# EAGLE design untitled (EAGLE 7.3.2)
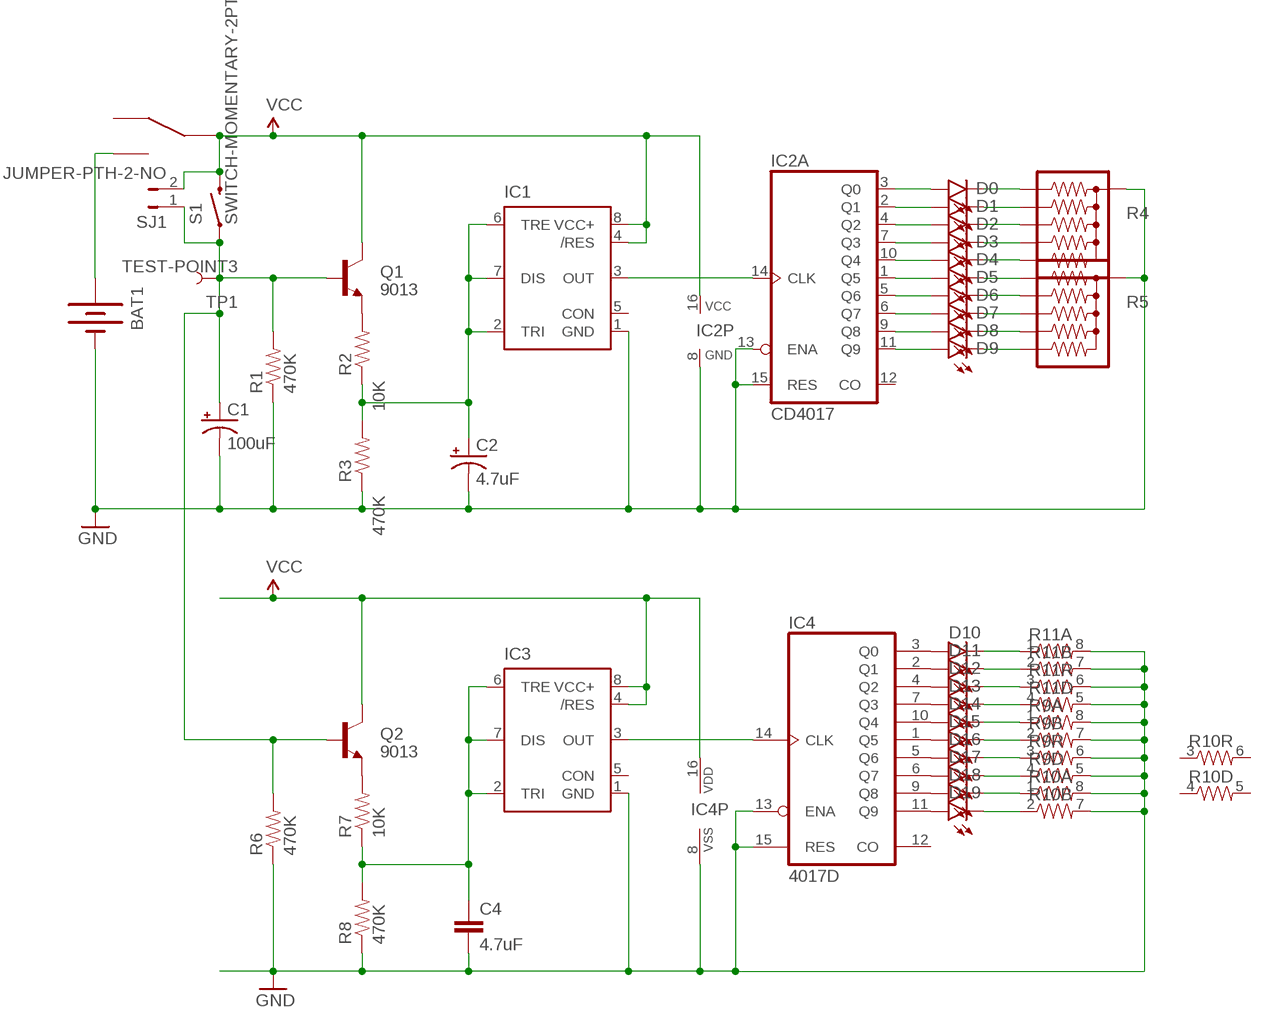
[diagram p0: schematic, sheet 1]

## Parts
BAT1  BATTERY20PTH  [BATTCOM_20MM_PTH]
C1  100uF  CAP_POLPTH1  [CPOL-RADIAL-100UF-25V]
C2  4.7uF  CAP_POLPTH1  [CPOL-RADIAL-100UF-25V]
C4  4.7uF  4.7UF-6.3V-10%(0603)0603  [0603-CAP]
D0  LED3MM  [LED3MM]
D1  LED3MM  [LED3MM]
D2  LED3MM  [LED3MM]
D3  LED3MM  [LED3MM]
D4  LED3MM  [LED3MM]
D5  LED3MM  [LED3MM]
D6  LED3MM  [LED3MM]
D7  LED3MM  [LED3MM]
D8  LED3MM  [LED3MM]
D9  LED3MM  [LED3MM]
D10  LED1206  [LED-1206]
D11  LED1206  [LED-1206]
D12  LED1206  [LED-1206]
D13  LED1206  [LED-1206]
D14  LED1206  [LED-1206]
D15  LED1206  [LED-1206]
D16  LED1206  [LED-1206]
D17  LED1206  [LED-1206]
D18  LED1206  [LED-1206]
D19  LED1206  [LED-1206]
IC1  NE555KIT  [DIP08-KIT]
IC2  CD4017  CD4017KIT  [DIL16-KIT]
IC3  NE555D  [SO08]
IC4  4017D  [SO16]
Q1  9013  TRANSISTOR_NPNTO-92-AMMO  [TO-92-AMMO]
Q2  9013  TRANSISTOR_NPNMMBT2222A  [SOT23-3]
R1  470K  RESISTORPTH-1/4W-VERT  [AXIAL-0.1]
R2  10K  RESISTORPTH-1/4W-VERT  [AXIAL-0.1]
R3  470K  RESISTORPTH-1/4W-VERT  [AXIAL-0.1]
R4  RPACK-BUSSED-5-SIP-PTH-5  [RPACK-SIP-PTH-5]
R5  RPACK-BUSSED-5-SIP-PTH-5  [RPACK-SIP-PTH-5]
R6  470K  470OHM1/10W1%(0603)  [0603-RES]
R7  10K  470OHM1/10W1%(0603)  [0603-RES]
R8  470K  470OHM1/10W1%(0603)  [0603-RES]
R9  RESISTOR-ARRAY0603-ARV  [0603-ARV]
R10  RESISTOR-ARRAY0603-ARV  [0603-ARV]
R11  RESISTOR-ARRAY0603-ARV  [0603-ARV]
S1  SWITCH-MOMENTARY-2PTH  [TACTILE-PTH]
SJ1  JUMPER-PTH-2-NO  [PTH-JUMPER-2-NO_NO_SILK]
TP1  TEST-POINT3  [PAD.03X.03]
U$1  KFT  [SWITCH_LOCK]

## Nets
GND: BAT1.2(-) C1.2(-) C2.2(-) C4.2 IC1.1(GND) IC2.8(P:GND) IC2.13(A:ENA) IC2.15(A:RES) IC3.1(GND) IC4.8(VSS) IC4.13(ENA) IC4.15(RES) R1.P$1 R3.P$1 R4.P$1 R5.P$1 R6.1 R8.1 R9.5 R9.6 R9.7 R9.8 R10.7 R10.8 R11.5 R11.6 R11.7 R11.8
N$1: D10.A IC4.3(Q0)
N$2: C1.1(+) Q1.2(B) Q2.1(B) R1.P$2 R6.2 S1.1 SJ1.1 TP1.P$1
N$3: Q2.2(E) R7.2
N$4: Q1.1(E) R2.P$2
N$5: C2.1(+) IC1.2(TRI) IC1.6(TRE) IC1.7(DIS) R2.P$1 R3.P$2
N$6: C4.1 IC3.2(TRI) IC3.6(TRE) IC3.7(DIS) R7.1 R8.2
N$7: IC3.3(OUT) IC4.14(CLK)
N$8: D11.A IC4.2(Q1)
N$9: D0.A IC2.3(A:Q0)
N$10: D1.A IC2.2(A:Q1)
N$11: D12.A IC4.4(Q2)
N$12: D2.A IC2.4(A:Q2)
N$13: IC1.3(OUT) IC2.14(A:CLK)
N$14: D13.A IC4.7(Q3)
N$15: D14.A IC4.10(Q4)
N$16: D15.A IC4.1(Q5)
N$17: D16.A IC4.5(Q6)
N$18: D17.A IC4.6(Q7)
N$19: D18.A IC4.9(Q8)
N$20: D3.A IC2.7(A:Q3)
N$21: D4.A IC2.10(A:Q4)
N$22: D5.A IC2.1(A:Q5)
N$23: D6.A IC2.5(A:Q6)
N$24: D7.A IC2.6(A:Q7)
N$25: D8.A IC2.9(A:Q8)
N$26: D9.A IC2.11(A:Q9)
N$27: D0.K(C) R4.P$2
N$28: D1.K(C) R4.P$3
N$29: D2.K(C) R4.P$4
N$30: D3.K(C) R4.P$5
N$31: D4.K(C) R4.P$6
N$32: D5.K(C) R5.P$2
N$33: D6.K(C) R5.P$3
N$34: D7.K(C) R5.P$4
N$35: D8.K(C) R5.P$5
N$36: D9.K(C) R5.P$6
N$37: D19.A IC4.11(Q9)
N$38: BAT1.1(+) U$1.S$3 U$1.S$4
N$40: D10.C R11.1
N$41: D11.C R11.2
N$42: D12.C R11.3
N$43: D13.C R11.4
N$44: D14.C R9.1
N$45: D15.C R9.2
N$46: D16.C R9.3
N$47: D17.C R9.4
N$48: D18.C R10.1
N$49: D19.C R10.2
VCC: IC1.4(/RES) IC1.8(VCC+) IC2.16(P:VCC) IC3.4(/RES) IC3.8(VCC+) IC4.16(VDD) Q1.3(C) Q2.3(C) S1.3 SJ1.2 U$1.S$2(P$C) U$1.S$5(P$C)
Unconnected: IC1.5(CON) IC2.12(A:CO) IC3.5(CON) IC4.12(CO) R10.3 R10.4 R10.5 R10.6 U$1.S$1 U$1.S$6

## Library data of the parts
BAT1 = SparkFun-Electromechanical:BATTERY: Battery Holders Various common sizes : AA, AAA, 18650 (PRT-12895), 20mm coin cell and 12mm coin cell. 20MM_4LEGS, BATT-10373
C1 C2 = SparkFun-Capacitors:CAP_POL: Capacitor Polarized These are standard SMD and PTH capacitors. Normally 10uF, 47uF, and 100uF in electrolytic and tantalum varieties. Always verify the external diameter of the through hole cap, it varies with capacity, voltage, and manufacturer. The EIA devices should be standard.
C4 = SparkFun-Capacitors:4.7UF-6.3V-10%(0603): CAP-08280; PROD_ID: CAP-08280
D0 D1-D19 = SparkFun-LED:LED: LEDs Standard schematic elements and footprints for 5mm, 3mm, 1206, and 0603 sized LEDs. 5mm - Spark Fun Electronics SKU : COM-00529 (and others)
IC1 = SparkFun-AnalogIC:NE555: General purpose bipolar Timer; PROD_ID: IC-11930
IC2 = SparkFun-DigitalIC:CD4017; PROD_ID: IC-11929
IC3 = SparkFun-AnalogIC:NE555: General purpose bipolar Timer
IC4 = 40xx:4017: COUNTER/DIVIDER
Q1 = SparkFun-DiscreteSemi:TRANSISTOR_NPN: Generic NPN BJT MMBT2222A - TRANS-08049 (SOT-23, 1A 40V) MPSA42 - TRANS-09116 (SOT-23, 500mA 300V) MMBT5088LT1G - TRANS-11160 (SOT-23, 50 mA 30V) BC547 - COM-08928 <http://www.sparkfun.com/products/8928> (TO-92 45V 100mA) (1.Collector 2.Base 3.Emitter) 2N3904 - COM-00521 <http://www.sparkfun.com/products/521> (TO-92 40V 200mA) (1.Emitter 2.Base 3.Collector) P2N2222A - COM-12852 <http://www.sparkfun.com/products/12852> (TO-92 40V 600mA) (1.Collector 2.Base 3.Emitter)
Q2 = SparkFun-DiscreteSemi:TRANSISTOR_NPN: Generic NPN BJT MMBT2222A - TRANS-08049 (SOT-23, 1A 40V) MPSA42 - TRANS-09116 (SOT-23, 500mA 300V) MMBT5088LT1G - TRANS-11160 (SOT-23, 50 mA 30V) BC547 - COM-08928 <http://www.sparkfun.com/products/8928> (TO-92 45V 100mA) (1.Collector 2.Base 3.Emitter) 2N3904 - COM-00521 <http://www.sparkfun.com/products/521> (TO-92 40V 200mA) (1.Emitter 2.Base 3.Collector) P2N2222A - COM-12852 <http://www.sparkfun.com/products/12852> (TO-92 40V 600mA) (1.Collector 2.Base 3.Emitter); PROD_ID: TRANS-08049; VALUE: MMBT2222A
R1-R3 = SparkFun-Resistors:RESISTOR: Resistor Basic schematic elements and footprints for 0603, 1206, and PTH resistors.
R4 R5 = SparkFun-Resistors:RPACK-BUSSED-5: BOURNS 4600X series thick-film SIP resistor packs Five resistors bussed to a single pin (denoted by dot). 0.2W / resistor datasheet <http://dlnmh9ip6v2uc.cloudfront.net/datasheets/Components/General/4600x.pdf> SFE parts COM-10855 (330), COM-10856 (10K)
R6-R8 = SparkFun-Resistors:470OHM1/10W1%(0603): RES-07869; PROD_ID: RES-07869; VALUE: 470
R9-R11 = SparkFun-Resistors:RESISTOR-ARRAY: Array Chip Resistor Source: RS Component / Phycomp
S1 = SparkFun-Electromechanical:SWITCH-MOMENTARY-2: Various NO switches- pushbuttons, reed, etc; PROD_ID: SWCH-08441
SJ1 = SparkFun-Passives:JUMPER-PTH-2-NO
TP1 = SparkFun-Passives:TEST-POINT: Bare copper test points for troubleshooting or ICT
U$1 = r1:KFT

## Board
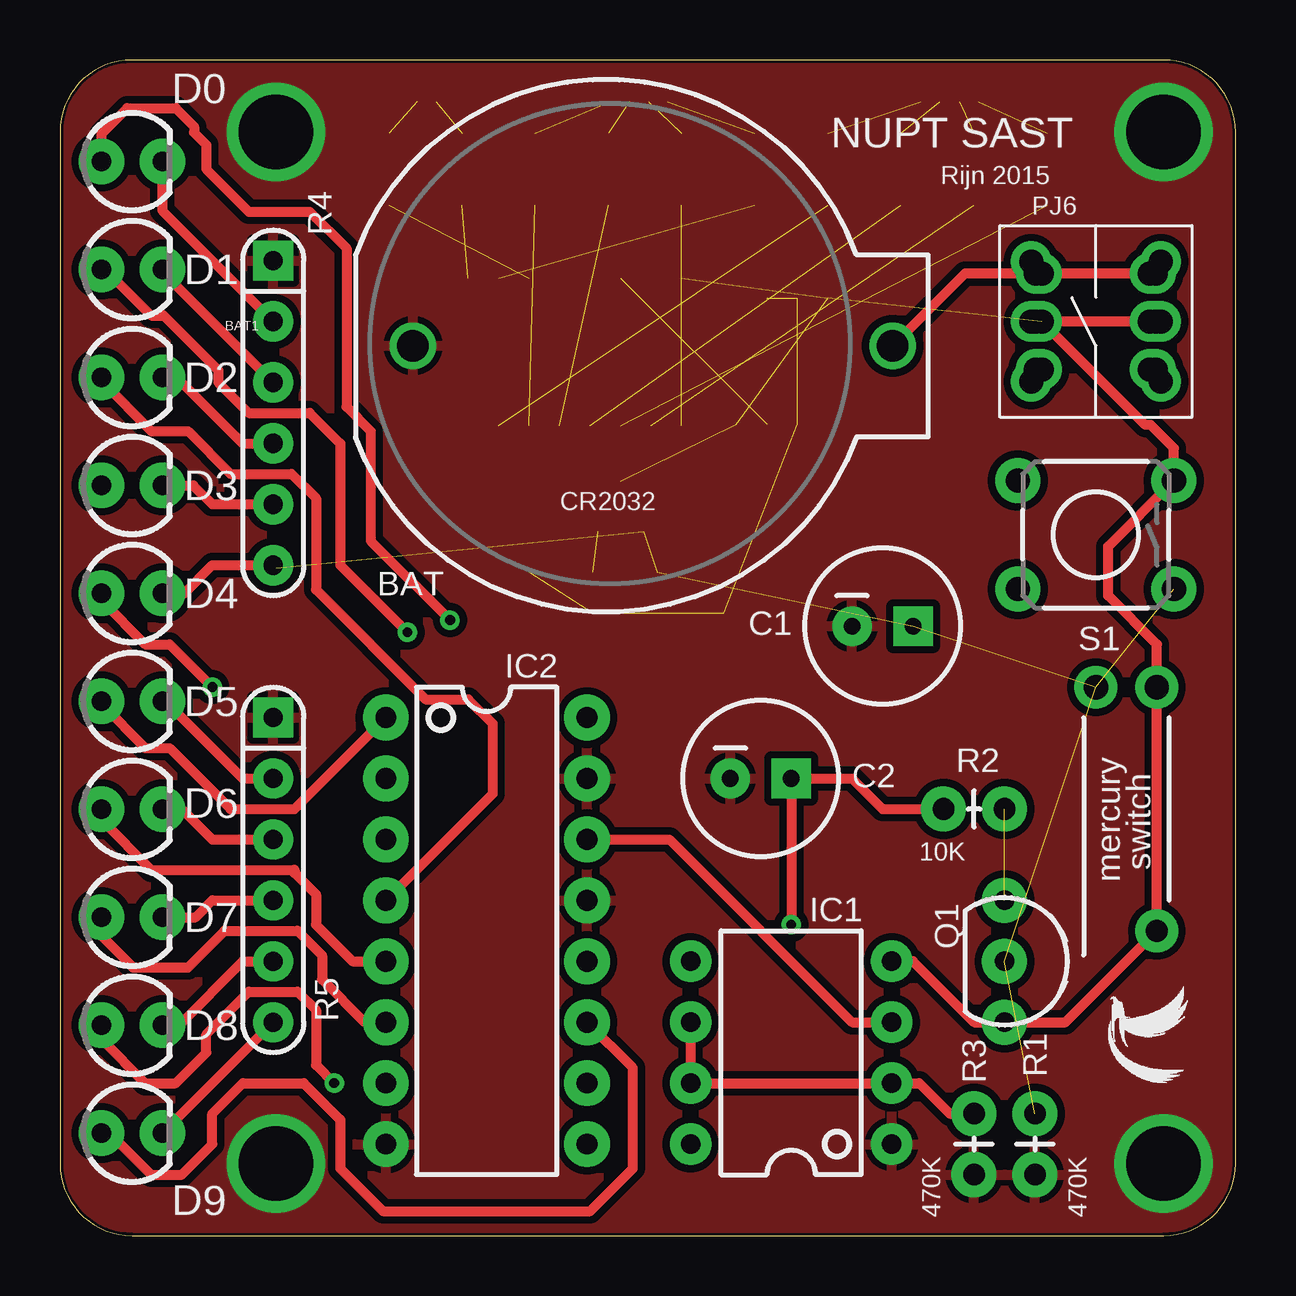
[diagram p1: board, top side]
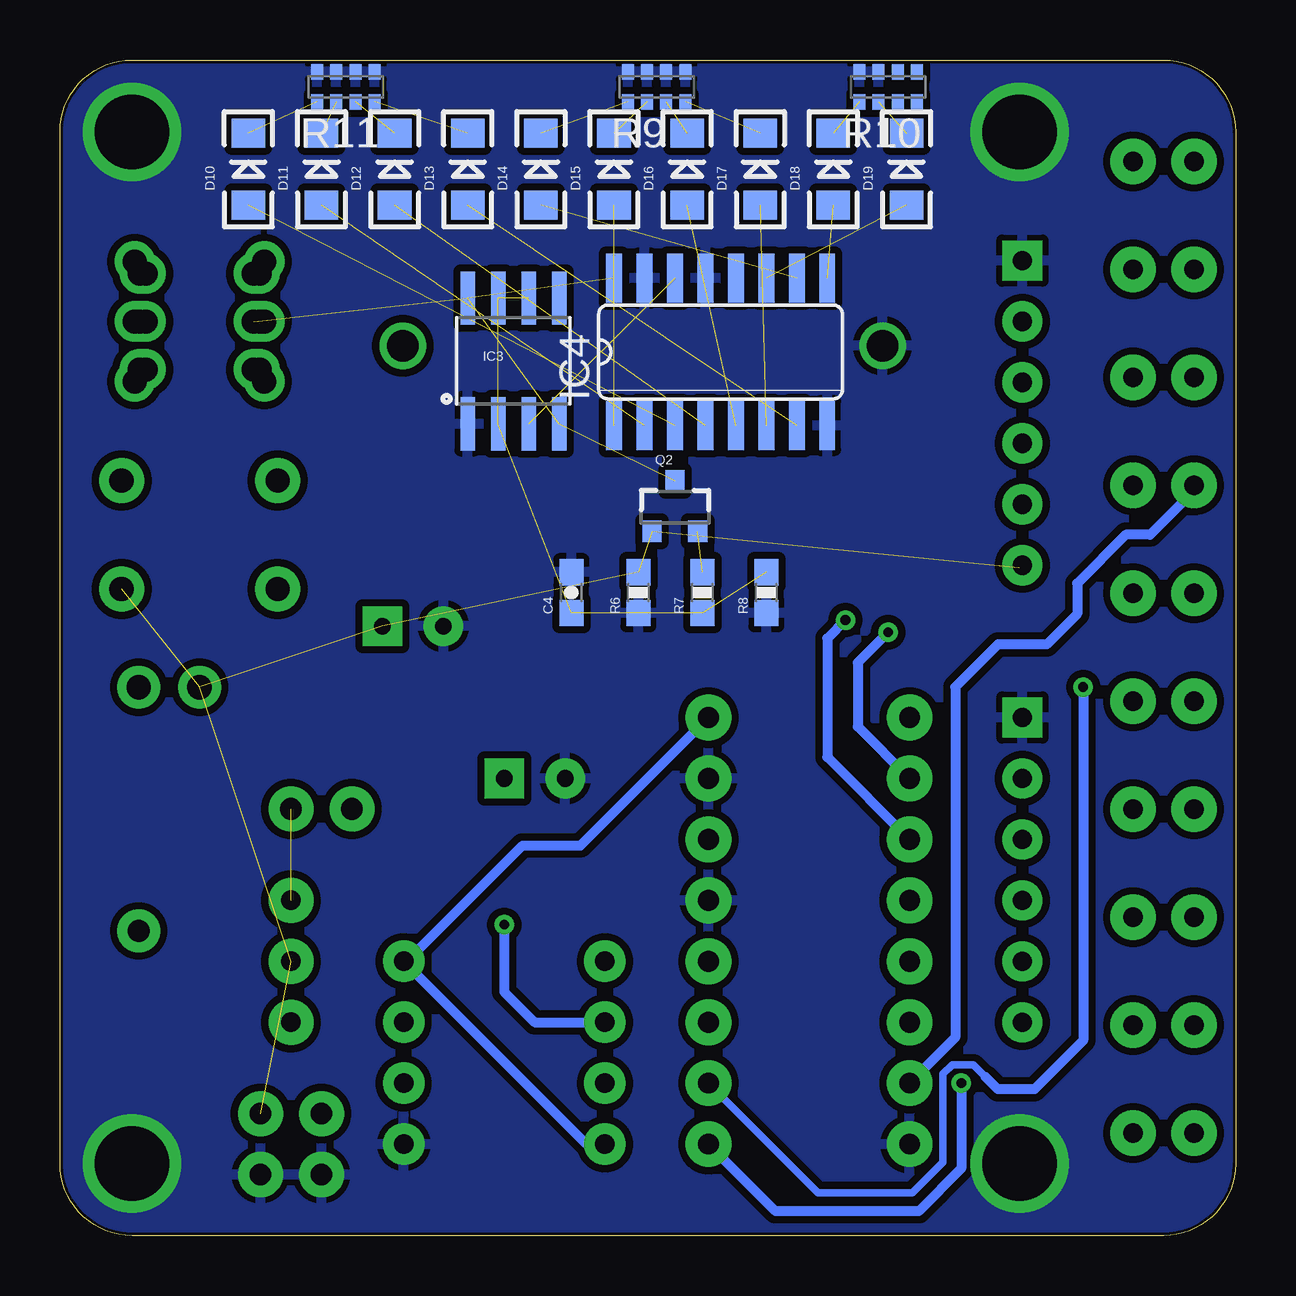
[diagram p2: board, bottom side, seen from below]

Size 49 x 49 mm. Coordinates in mm from the lower left corner, seen from the top.
Outline: 0,46 0,3 arc90 3,0 46,0 arc90 49,3 49,46 arc90 46,49 3,49 arc90 0,46
Copper layers (1*16): Top 0.035mm / dielectric 1.5mm / Bottom 0.035mm
Design rules "default *": minimum track width 6mil, minimum drill 12mil, track to track 12mil, track to pad 6mil, pad to pad 6mil, via to via 6mil, smd to smd 6mil, copper to edge 1mil, drill to drill 6mil, minimum pad ring 10mil, minimum via ring 8mil, stop-mask expansion 4mil, vias tented up to drill 12mil, thermal gap 10mil

### Footprints (pad centres in the part's own frame; a part is rotated, then mirrored left to right if it is on the bottom)
BATTCOM_20MM_PTH = drill 1.3: 1 11.85,0; 2 -8.15,0
CPOL-RADIAL-100UF-25V = drill 0.7 pad 1.651 square: 1 1.27,0 | drill 0.7 pad 1.651: 2 -1.27,0
0603-CAP = smd 1.1 x 1: 1 -0.85,0; 2 0.85,0
LED3MM = drill 0.813 pad 1.88: A -1.27,0; K 1.27,0
LED-1206 = smd 1.2 x 1.4: A -1.5,0; C 1.5,0
DIP08-KIT = drill 0.813 pad 1.727: 1 -3.81,-4.191; 2 -1.27,-4.191; 3 1.27,-4.191; 4 3.81,-4.191; 5 3.81,4.191; 6 1.27,4.191; 7 -1.27,4.191; 8 -3.81,4.191
DIL16-KIT = drill 0.864 pad 1.905: 1 -8.89,-4.191; 2 -6.35,-4.191; 3 -3.81,-4.191; 4 -1.27,-4.191; 5 1.27,-4.191; 6 3.81,-4.191; 7 6.35,-4.191; 8 8.89,-4.191; 9 8.89,4.191; 10 6.35,4.191; 11 3.81,4.191; 12 1.27,4.191; 13 -1.27,4.191; 14 -3.81,4.191; 15 -6.35,4.191; 16 -8.89,4.191
SO08 = smd 0.61 x 2.21: 1 -1.905,-2.616; 2 -0.635,-2.616; 3 0.635,-2.616; 4 1.905,-2.616; 5 1.905,2.616; 6 0.635,2.616; 7 -0.635,2.616; 8 -1.905,2.616
SO16 = smd 0.66 x 2.032: 1 -4.445,-3.073; 2 -3.175,-3.073; 3 -1.905,-3.073; 4 -0.635,-3.073; 5 0.635,-3.073; 6 1.905,-3.073; 7 3.175,-3.073; 8 4.445,-3.073; 9 4.445,3.073; 10 3.175,3.073; 11 1.905,3.073; 12 0.635,3.073; 13 -0.635,3.073; 14 -1.905,3.073; 15 -3.175,3.073; 16 -4.445,3.073
TO-92-AMMO = drill 0.813 pad 1.88: 1 -2.54,0; 2 0,0; 3 2.54,0
SOT23-3 = smd 0.8 x 0.9: 1 -0.95,-1; 2 0.95,-1; 3 0,1.1
AXIAL-0.1 = drill 0.9 pad 1.88: P$1 0,0; P$2 2.54,0
RPACK-SIP-PTH-5 = drill 0.8 pad 1.676 square: P$1 0,0 | drill 0.8 pad 1.676: P$2 0,-2.54; P$3 0,-5.08; P$4 0,-7.62; P$5 0,-10.16; P$6 0,-12.7
0603-RES = smd 1.1 x 1: 1 -0.85,0; 2 0.85,0
0603-ARV = smd 0.5 x 0.65: 1 -1.2,-0.625; 2 -0.4,-0.625; 3 0.4,-0.625; 4 1.2,-0.625; 5 1.2,0.625; 6 0.4,0.625; 7 -0.4,0.625; 8 -1.2,0.625
TACTILE-PTH = drill 1.016 pad 1.88: 1 -3.251,2.261; 2 3.251,2.261; 3 -3.251,-2.261; 4 3.251,-2.261
PTH-JUMPER-2-NO_NO_SILK = drill 1.016 pad 1.778: 1 -1.27,0; 2 1.27,0
PAD.03X.03 = smd 0.762 x 0.762: P$1 0,0
SWITCH_LOCK = drill 1 pad 1.676: P$1 -2.5,2.7; P$2 -2,2.5; P$5 0,2.5; P$6 0,2.7; P$8 2,2.5; P$9 2.5,2.7; P$11 -2,-2.5; P$12 -2.5,-2.7; P$14 0,-2.5; P$15 0,-2.7; P$17 2,-2.5; P$18 2.5,-2.7; S$1 -2,2.25; S$2 0,2.25; S$3 2,2.25; S$4 2,-2.25; S$5 0,-2.25; S$6 -2,-2.25

### Placement (x,y rotation side)
BAT1  22.86,37.08 0 top
C1  34.29,25.4 0 top
C2  29.21,19.05 0 top
C4  27.69,26.8 90 bottom
D0  3,44.77 0 top
D1  3,40.27 0 top
D2  3,35.77 0 top
D3  3,31.27 0 top
D4  3,26.77 0 top
D5  3,22.27 0 top
D6  3,17.77 0 top
D7  3,13.27 0 top
D8  3,8.77 0 top
D9  3,4.27 0 top
D10  41.15,44.45 90 bottom
D11  38.1,44.45 90 bottom
D12  35.05,44.45 90 bottom
D13  32,44.45 90 bottom
D14  28.96,44.45 90 bottom
D15  25.91,44.45 90 bottom
D16  22.86,44.45 90 bottom
D17  19.81,44.45 90 bottom
D18  16.76,44.45 90 bottom
D19  13.72,44.45 90 bottom
IC1  30.48,7.62 90 top
IC2  17.78,12.7 270 top
IC3  30.1,36.45 0 bottom
IC4  21.46,36.83 0 bottom
Q1  39.37,11.43 270 top
Q2  23.37,30.35 0 bottom
R1  40.64,2.54 90 top
R2  36.83,17.78 0 top
R3  38.1,2.54 90 top
R4  8.89,40.64 0 top
R5  8.89,21.59 0 top
R6  24.89,26.8 90 bottom
R7  22.23,26.8 90 bottom
R8  19.56,26.8 90 bottom
R9  24.13,47.88 0 bottom
R10  14.48,47.88 0 bottom
R11  37.08,47.88 0 bottom
S1  43.18,29.21 180 top
SJ1  44.45,22.86 0 top
TP1  9.02,27.81 90 bottom
U$1  43.18,38.1 90 top
U$2  [LOGO]  43.69,6.35 0 top

### Tracks (layer width: path | path; a pad name or v marks a point on that pad's centre or on a via)
GND  (via drill 3.1)
  other vias: 9,46 46,46 46,3 9,3
  pour Bottom (isolate 0.127): -2,54 53,54 arc-90 56,51 56,-4 1,-4 arc-90 -2,-1
  pour Top (isolate 0.127, rank 6): -8,56 47,56 arc-90 50,53 50,-2 -5,-2 arc-90 -8,1
N$1  (1 unrouted)
N$2  (7 unrouted)
N$3  (1 unrouted)
N$4  (1 unrouted)
N$5  (via drill 0.41)
  Top 0.406: R2.P$1 34.29,17.78 33.02,19.05 C2.1 v30.48,12.95 | IC1.6 IC1.7 IC1.2 35.81,6.35 37.08,5.08 R3.P$2
  Bottom 0.406: v30.48,12.95 30.48,10.16 29.21,8.89 IC1.6
N$6  (5 unrouted)
N$7  (1 unrouted)
N$8  (1 unrouted)
N$9  (via drill 0.41)
  Top 0.406: D0.A 1.73,45.93 2.79,46.99 4.83,46.99 5.59,46.23 5.59,45.97 6.1,45.47 6.1,44.45 7.87,42.67 10.41,42.67 11.94,41.15 11.94,34.54 12.95,33.53 12.95,28.96 v16.26,25.65
  Bottom 0.406: v16.26,25.65 17.02,24.89 17.02,19.94 IC2.3
N$10  (via drill 0.41)
  Top 0.406: D1.A 1.89,40.27 3.81,38.35 4.32,38.35 6.6,36.07 6.6,35.56 7.87,34.29 10.41,34.29 11.68,33.02 11.68,27.94 v14.48,25.15
  Bottom 0.406: v14.48,25.15 15.75,23.88 15.75,21.21 IC2.2
N$11  (1 unrouted)
N$12
  Top 0.406: D2.A 1.73,35.61 3.81,33.53 5.33,33.53 7.11,31.75 9.65,31.75 10.67,30.73 10.67,26.92 15.24,22.35 17.02,22.35 18.03,21.34 18.03,18.41 IC2.4
N$13
  Top 0.406: IC2.14 25.4,16.51 33.02,8.89 IC1.3
N$14  (1 unrouted)
N$15  (1 unrouted)
N$16  (1 unrouted)
N$17  (1 unrouted)
N$18  (1 unrouted)
N$19  (1 unrouted)
N$20
  Bottom 0.406: D3.A 1.73,31.04 3.56,29.21 4.57,29.21 6.6,27.18 6.6,25.91 7.87,24.64 9.91,24.64 11.68,22.86 11.68,8.26 IC2.7
N$21  (via drill 0.41)
  Top 0.406: D4.A 1.73,26.46 3.56,24.64 4.57,24.64 v6.35,22.86
  Bottom 0.305: 10.41,6.6 10.92,7.11 11.81,7.11 12.19,6.73 12.19,3.05 13.46,1.78 17.4,1.78 IC2.10
  Bottom 0.406: v6.35,22.86 6.35,8.13 8.38,6.1 9.91,6.1 10.41,6.6
N$22
  Top 0.406: D5.A 1.73,22.15 3.56,20.32 4.57,20.32 7.11,17.78 9.78,17.78 IC2.1
N$23
  Top 0.406: D6.A 1.73,17.32 3.81,15.24 9.78,15.24 9.78,15.11 10.67,14.22 10.67,12.95 12.19,11.43 IC2.5
N$24
  Top 0.406: D7.A 1.73,12.49 3.05,11.18 5.33,11.18 6.86,12.7 9.91,12.7 10.92,11.68 10.92,10.67 12.7,8.89 IC2.6
N$25  (via drill 0.41)
  Top 0.406: D8.A 1.73,8.18 3.56,6.35 4.83,6.35 6.1,7.62 6.1,8.38 7.87,10.16 9.91,10.16 10.67,9.4 10.67,7.11 v11.43,6.35
  Bottom 0.406: v11.43,6.35 11.43,2.79 13.21,1.02 19.18,1.02 IC2.9
N$26
  Top 0.406: D9.A 2.08,4.27 3.81,2.54 5.08,2.54 6.35,3.81 6.35,5.08 7.62,6.35 10.16,6.35 11.68,4.83 11.68,2.79 13.46,1.02 22.1,1.02 23.88,2.79 23.88,6.99 IC2.11
N$27
  Top 0.406: D0.K 4.27,42.72 R4.P$2
N$28
  Top 0.406: D1.K 4.27,40.18 R4.P$3
N$29
  Top 0.406: D2.K 4.87,35.77 7.62,33.02 R4.P$4
N$30
  Top 0.406: D3.K 5.56,31.27 6.35,30.48 R4.P$5
N$31
  Top 0.406: D4.K 5.18,26.77 6.35,27.94 R4.P$6
N$32
  Top 0.406: D5.K 4.4,22.27 7.62,19.05 R5.P$2
N$33
  Top 0.406: D6.K 5.07,17.77 5.08,17.78 6.35,16.51 R5.P$3
N$34
  Top 0.406: D7.K 5.65,13.27 6.35,13.97 R5.P$4
N$35
  Top 0.406: D8.K 4.96,8.77 7.62,11.43 R5.P$5
N$36
  Top 0.406: D9.K R5.P$6
N$37  (1 unrouted)
N$38
  Top 0.406: U$1.S$4 U$1.S$3 37.73,40.1 BAT1.1
N$40  (1 unrouted)
N$41  (1 unrouted)
N$42  (1 unrouted)
N$43  (1 unrouted)
N$44  (1 unrouted)
N$45  (1 unrouted)
N$46  (1 unrouted)
N$47  (1 unrouted)
N$48  (1 unrouted)
N$49  (1 unrouted)
VCC  (via drill 0.91 pad 1.78)  (4 unrouted)
  Top 0.406: IC1.4 35.56,11.43 38.1,8.89 Q1.3 41.91,8.89 v45.72,12.7 SJ1.2 45.72,24.64 43.69,26.67 43.69,28.73 S1.3 46.43,32.82 45.47,33.78 45.25,33.78 U$1.S$2 U$1.S$5
  Bottom 0.406: IC1.8 27.05,3.81 IC1.4 34.54,11.43 29.72,16.26 27.3,16.26 IC2.16

### Text on the board
tNames: NUPT SAST | Rijn 2015 | PJ6 | CR2032 | BAT | mercury | switch
tValues: NE555